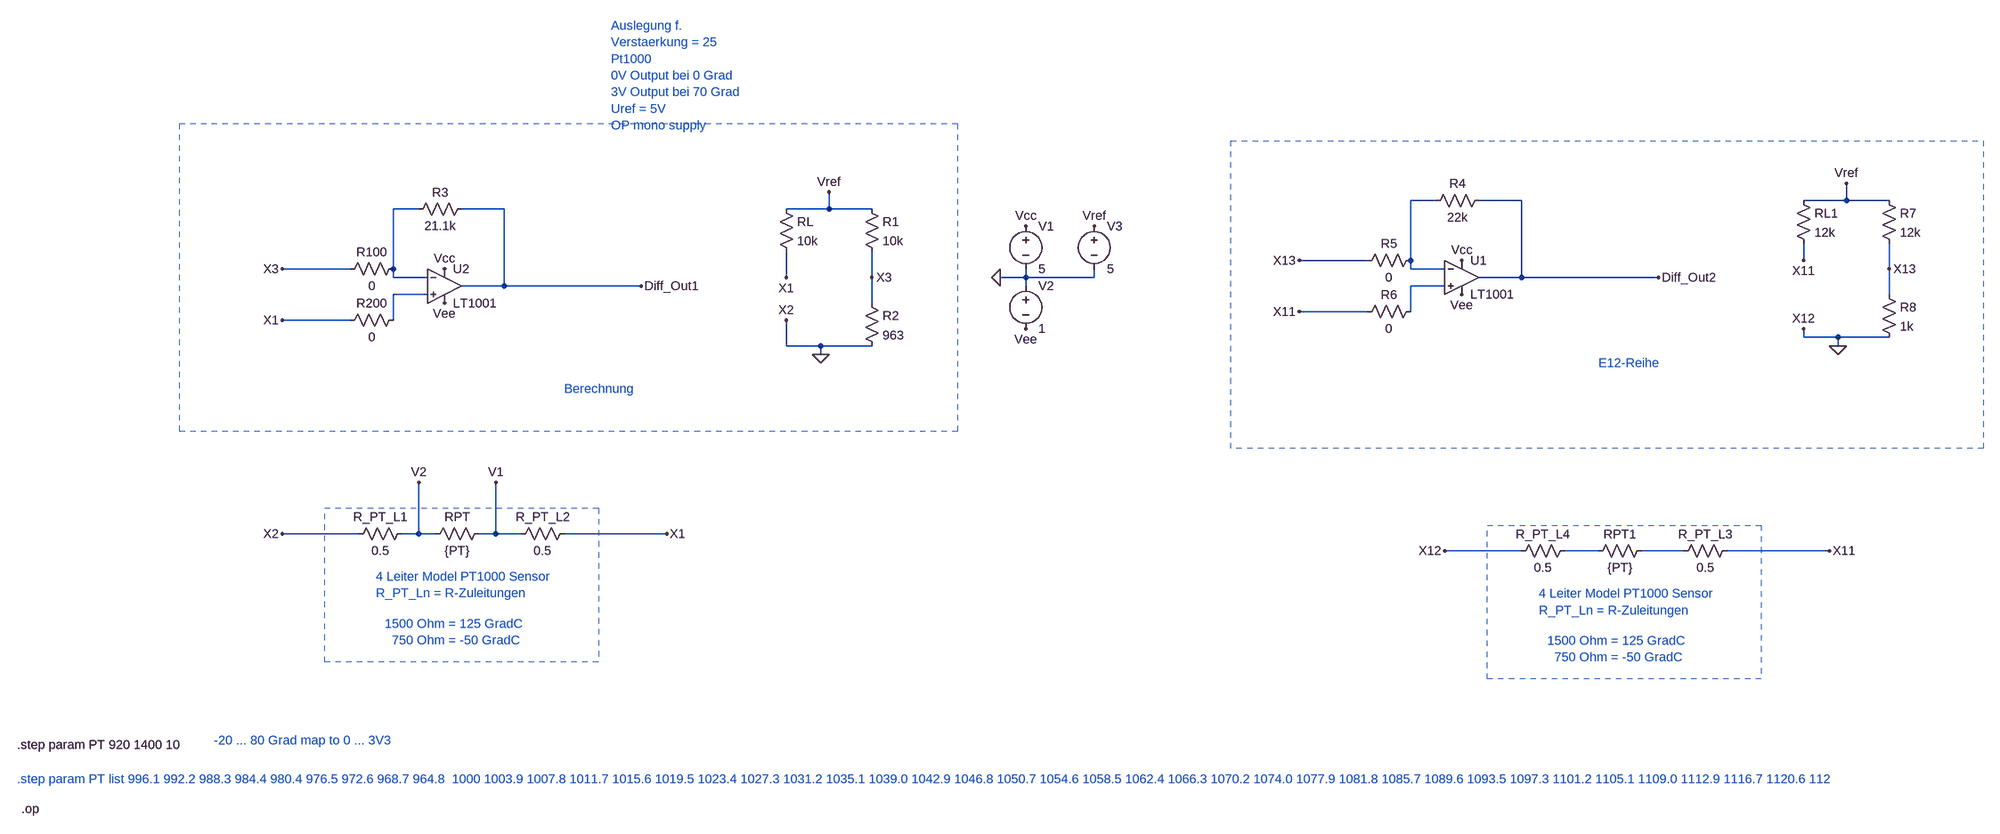
[diagram p0: schematic pt1000_messwandler_single_oamp.asc]
pt1000_messwandler_single_oamp.asc, the LTspice schematic file:
Version 4
SHEET 1 8776 1956
WIRE 2768 400 2720 400
WIRE 2928 400 2848 400
WIRE 3536 400 3536 368
WIRE 3536 400 3456 400
WIRE 3616 400 3536 400
WIRE 864 416 816 416
WIRE 1024 416 944 416
WIRE 1632 416 1632 384
WIRE 1632 416 1552 416
WIRE 1712 416 1632 416
WIRE 2640 512 2512 512
WIRE 2720 512 2720 400
WIRE 3456 512 3456 480
WIRE 736 528 608 528
WIRE 816 528 816 416
WIRE 2720 528 2720 512
WIRE 2784 528 2720 528
WIRE 3616 528 3616 480
WIRE 816 544 816 528
WIRE 880 544 816 544
WIRE 1552 544 1552 496
WIRE 1712 544 1712 496
WIRE 2000 544 2000 528
WIRE 2000 544 1952 544
WIRE 2128 544 2128 528
WIRE 2128 544 2000 544
WIRE 2928 544 2928 400
WIRE 2928 544 2848 544
WIRE 3184 544 2928 544
WIRE 1024 560 1024 416
WIRE 1024 560 944 560
WIRE 1280 560 1024 560
WIRE 2000 560 2000 544
WIRE 2784 560 2720 560
WIRE 880 576 816 576
WIRE 3616 576 3616 528
WIRE 1712 592 1712 544
WIRE 2640 608 2512 608
WIRE 2720 608 2720 560
WIRE 736 624 608 624
WIRE 816 624 816 576
WIRE 3456 656 3456 640
WIRE 3520 656 3456 656
WIRE 3616 656 3520 656
WIRE 1552 672 1552 624
WIRE 1616 672 1552 672
WIRE 1712 672 1616 672
WIRE 3520 672 3520 656
WIRE 1616 688 1616 672
WIRE 752 1024 608 1024
WIRE 864 1024 864 928
WIRE 864 1024 832 1024
WIRE 896 1024 864 1024
WIRE 1008 1024 1008 928
WIRE 1008 1024 976 1024
WIRE 1056 1024 1008 1024
WIRE 1328 1024 1136 1024
WIRE 2928 1056 2784 1056
WIRE 3072 1056 3008 1056
WIRE 3232 1056 3152 1056
WIRE 3504 1056 3312 1056
FLAG 1952 544 0
FLAG 2000 448 Vcc
FLAG 2000 640 Vee
FLAG 912 528 Vcc
FLAG 912 592 Vee
FLAG 1280 560 Diff_Out1
FLAG 608 1024 X2
FLAG 1328 1024 X1
FLAG 864 928 V2
FLAG 1008 928 V1
FLAG 608 528 X3
FLAG 608 624 X1
FLAG 1552 624 X2
FLAG 1552 544 X1
FLAG 1616 688 0
FLAG 1712 544 X3
FLAG 2128 448 Vref
FLAG 1632 384 Vref
FLAG 2816 512 Vcc
FLAG 2816 576 Vee
FLAG 3184 544 Diff_Out2
FLAG 2512 512 X13
FLAG 2512 608 X11
FLAG 3456 640 X12
FLAG 3456 512 X11
FLAG 3520 672 0
FLAG 3616 528 X13
FLAG 3536 368 Vref
FLAG 2784 1056 X12
FLAG 3504 1056 X11
SYMBOL voltage 2000 432 R0
WINDOW 123 0 0 Left 0
WINDOW 39 0 0 Left 0
SYMATTR InstName V1
SYMATTR Value 5
SYMBOL voltage 2000 544 R0
WINDOW 123 0 0 Left 0
WINDOW 39 0 0 Left 0
SYMATTR InstName V2
SYMATTR Value 1
SYMBOL res 992 1008 R90
WINDOW 0 0 56 VBottom 2
WINDOW 3 32 56 VTop 2
SYMATTR InstName RPT
SYMATTR Value {PT}
SYMBOL OpAmps\\LT1001 912 496 R0
SYMATTR InstName U2
SYMBOL res 960 400 R90
WINDOW 0 0 56 VBottom 2
WINDOW 3 32 56 VTop 2
SYMATTR InstName R3
SYMATTR Value 21.1k
SYMBOL res 832 512 R90
WINDOW 0 0 56 VBottom 2
WINDOW 3 32 56 VTop 2
SYMATTR InstName R100
SYMATTR Value 0
SYMBOL res 832 608 R90
WINDOW 0 0 56 VBottom 2
WINDOW 3 32 56 VTop 2
SYMATTR InstName R200
SYMATTR Value 0
SYMBOL res 1152 1008 R90
WINDOW 0 0 56 VBottom 2
WINDOW 3 32 56 VTop 2
SYMATTR InstName R_PT_L2
SYMATTR Value 0.5
SYMBOL res 848 1008 R90
WINDOW 0 0 56 VBottom 2
WINDOW 3 32 56 VTop 2
SYMATTR InstName R_PT_L1
SYMATTR Value 0.5
SYMBOL res 1536 400 R0
SYMATTR InstName RL
SYMATTR Value 10k
SYMBOL res 1696 400 R0
SYMATTR InstName R1
SYMATTR Value 10k
SYMBOL res 1696 576 R0
SYMATTR InstName R2
SYMATTR Value 963
SYMBOL voltage 2128 432 R0
WINDOW 123 0 0 Left 0
WINDOW 39 0 0 Left 0
SYMATTR InstName V3
SYMATTR Value 5
SYMBOL OpAmps\\LT1001 2816 480 R0
SYMATTR InstName U1
SYMBOL res 2864 384 R90
WINDOW 0 0 56 VBottom 2
WINDOW 3 32 56 VTop 2
SYMATTR InstName R4
SYMATTR Value 22k
SYMBOL res 2736 496 R90
WINDOW 0 0 56 VBottom 2
WINDOW 3 32 56 VTop 2
SYMATTR InstName R5
SYMATTR Value 0
SYMBOL res 2736 592 R90
WINDOW 0 0 56 VBottom 2
WINDOW 3 32 56 VTop 2
SYMATTR InstName R6
SYMATTR Value 0
SYMBOL res 3440 384 R0
SYMATTR InstName RL1
SYMATTR Value 12k
SYMBOL res 3600 384 R0
SYMATTR InstName R7
SYMATTR Value 12k
SYMBOL res 3600 560 R0
SYMATTR InstName R8
SYMATTR Value 1k
SYMBOL res 3168 1040 R90
WINDOW 0 0 56 VBottom 2
WINDOW 3 32 56 VTop 2
SYMATTR InstName RPT1
SYMATTR Value {PT}
SYMBOL res 3328 1040 R90
WINDOW 0 0 56 VBottom 2
WINDOW 3 32 56 VTop 2
SYMATTR InstName R_PT_L3
SYMATTR Value 0.5
SYMBOL res 3024 1040 R90
WINDOW 0 0 56 VBottom 2
WINDOW 3 32 56 VTop 2
SYMATTR InstName R_PT_L4
SYMATTR Value 0.5
TEXT 784 1104 Left 2 ;4 Leiter Model PT1000 Sensor\nR_PT_Ln = R-Zuleitungen
TEXT 800 1192 Left 2 ;1500 Ohm = 125 GradC\n  750 Ohm = -50 GradC
TEXT 112 1568 Left 2 ;.step param PT list 996.1 992.2 988.3 984.4 980.4 976.5 972.6 968.7 964.8  1000 1003.9 1007.8 1011.7 1015.6 1019.5 1023.4 1027.3 1031.2 1035.1 1039.0 1042.9 1046.8 1050.7 1054.6 1058.5 1062.4 1066.3 1070.2 1074.0 1077.9 1081.8 1085.7 1089.6 1093.5 1097.3 1101.2 1105.1 1109.0 1112.9 1116.7 1120.6 1124.5 1128.3 1132.2 1136.1 1140.0 1143.8 1147.7 1151.5 1155.4 1159.3 1163.1 1167.0 1170.8 1174.7 1178.6 1182.4 1186.3 1190.1 1194.0 1197.8 1201.7 1205.5 1209.4 1213.2 1217.1 1220.9 1224.7 1228.6 1232.4 1236.3 1240.1 1243.9 1247.8 1251.6 1255.4 1259.3 1263.1 1266.9 1270.8 1274.6 1278.4 1282.2 1286.1 1289.9 1293.7 1297.5 1301.3 1305.2
TEXT 120 1624 Left 2 !.op
TEXT 1224 72 Left 2 ;Auslegung f. \nVerstaerkung = 25\nPt1000\n0V Output bei 0 Grad\n3V Output bei 70 Grad\nUref = 5V\nOP mono supply
TEXT 1136 752 Left 2 ;Berechnung
TEXT 3072 704 Left 2 ;E12-Reihe
TEXT 2960 1136 Left 2 ;4 Leiter Model PT1000 Sensor\nR_PT_Ln = R-Zuleitungen
TEXT 2976 1224 Left 2 ;1500 Ohm = 125 GradC\n  750 Ohm = -50 GradC
TEXT 112 1504 Left 2 !.step param PT 920 1400 10
TEXT 480 1496 Left 2 ;-20 ... 80 Grad map to 0 ... 3V3
RECTANGLE Normal 1200 1264 688 976 2
RECTANGLE Normal 1872 832 416 256 2
RECTANGLE Normal 3792 864 2384 288 2
RECTANGLE Normal 3376 1296 2864 1008 2

The netlist it stands for:
* pt1000_messwandler_single_oamp.asc
V1 Vcc 0 5
V2 0 Vee 1
RPT V1 V2 {PT}
XU2 N004 N002 Vcc Vee Diff_Out1 LT1001  ; pins In+ In- V+ V- OUT
R3 Diff_Out1 N002 21.1k
R100 N002 X3 0
R200 N004 X1 0
R_PT_L2 X1 V1 0.5
R_PT_L1 V2 0 0.5
RL Vref X1 10k
R1 Vref X3 10k
R2 X3 0 963
V3 Vref 0 5
XU1 N003 N001 Vcc Vee Diff_Out2 LT1001  ; pins In+ In- V+ V- OUT
R4 Diff_Out2 N001 22k
R5 N001 X13 0
R6 N003 X11 0
RL1 Vref X11 12k
R7 Vref X13 12k
R8 X13 0 1k
RPT1 N006 N005 {PT}
R_PT_L3 X11 N006 0.5
R_PT_L4 N005 0 0.5
* 4 Leiter Model PT1000 Sensor
* R_PT_Ln = R-Zuleitungen
* 1500 Ohm = 125 GradC
*   750 Ohm = -50 GradC
* .step param PT list 996.1 992.2 988.3 984.4 980.4 976.5 972.6 968.7 964.8  1000 1003.9 1007.8 1011.7 1015.6 1019.5 1023.4 1027.3 1031.2 1035.1 1039.0 1042.9 1046.8 1050.7 1054.6 1058.5 1062.4 1066.3 1070.2 1074.0 1077.9 1081.8 1085.7 1089.6 1093.5 1097.3 1101.2 1105.1 1109.0 1112.9 1116.7 1120.6 1124.5 1128.3 1132.2 1136.1 1140.0 1143.8 1147.7 1151.5 1155.4 1159.3 1163.1 1167.0 1170.8 1174.7 1178.6 1182.4 1186.3 1190.1 1194.0 1197.8 1201.7 1205.5 1209.4 1213.2 1217.1 1220.9 1224.7 1228.6 1232.4 1236.3 1240.1 1243.9 1247.8 1251.6 1255.4 1259.3 1263.1 1266.9 1270.8 1274.6 1278.4 1282.2 1286.1 1289.9 1293.7 1297.5 1301.3 1305.2
.op
* Auslegung f.
* Verstaerkung = 25
* Pt1000
* 0V Output bei 0 Grad
* 3V Output bei 70 Grad
* Uref = 5V
* OP mono supply
* Berechnung
* E12-Reihe
* 4 Leiter Model PT1000 Sensor
* R_PT_Ln = R-Zuleitungen
* 1500 Ohm = 125 GradC
*   750 Ohm = -50 GradC
.step param PT 920 1400 10
* -20 ... 80 Grad map to 0 ... 3V3
.lib LTC.lib
.backanno
.end